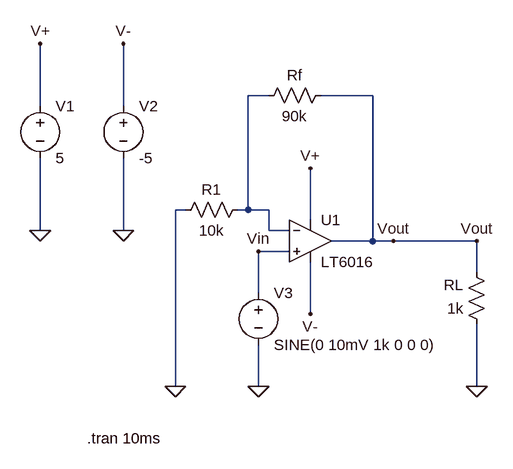
[diagram p0: schematic Draft2.asc]
Draft2.asc, the LTspice schematic file:
Version 4.1
SHEET 1 880 680
WIRE 208 -64 176 -64
WIRE 368 -64 288 -64
WIRE -144 -48 -144 -144
WIRE -16 -48 -16 -144
WIRE 80 112 64 112
WIRE 176 112 176 -64
WIRE 176 112 160 112
WIRE 208 112 176 112
WIRE 272 128 272 48
WIRE -144 144 -144 32
WIRE -16 144 -16 32
WIRE 208 144 208 112
WIRE 240 144 208 144
WIRE 368 160 368 -64
WIRE 368 160 304 160
WIRE 400 160 368 160
WIRE 528 160 400 160
WIRE 240 176 192 176
WIRE 528 208 528 160
WIRE 192 240 192 176
WIRE 272 272 272 192
WIRE 64 384 64 112
WIRE 192 384 192 320
WIRE 528 384 528 288
FLAG -144 144 0
FLAG -16 144 0
FLAG 64 384 0
FLAG 192 384 0
FLAG 528 384 0
FLAG -144 -144 V+
FLAG -16 -144 V-
FLAG 272 48 V+
FLAG 528 160 Vout
FLAG 272 272 V-
FLAG 192 176 Vin
FLAG 400 160 Vout
SYMBOL OpAmps\\LT6016 272 160 R0
SYMATTR InstName U1
SYMBOL voltage -144 -64 R0
SYMATTR InstName V1
SYMATTR Value 5
SYMBOL voltage -16 -64 R0
SYMATTR InstName V2
SYMATTR Value -5
SYMBOL res 176 96 R90
WINDOW 0 0 56 VBottom 2
WINDOW 3 32 56 VTop 2
SYMATTR InstName R1
SYMATTR Value 10k
SYMBOL res 304 -80 R90
WINDOW 0 0 56 VBottom 2
WINDOW 3 32 56 VTop 2
SYMATTR InstName Rf
SYMATTR Value 90k
SYMBOL res 544 304 R180
WINDOW 0 36 76 Left 2
WINDOW 3 36 40 Left 2
SYMATTR InstName RL
SYMATTR Value 1k
SYMBOL voltage 192 224 R0
SYMATTR InstName V3
SYMATTR Value SINE(0 10mV 1k 0 0 0)
TEXT -72 464 Left 2 !.tran 10ms

The netlist it stands for:
* Draft2.asc
* U1: LT6016 (symbol OpAmps\LT6016 not available, pins judged from their places): In+=Vin In-=N001 V+=V+ V-=V- OUT=Vout
V1 V+ 0 5
V2 V- 0 -5
R1 N001 0 10k
Rf Vout N001 90k
RL 0 Vout 1k
V3 Vin 0 SINE(0 10mV 1k 0 0 0)
.tran 10ms
.backanno
.end